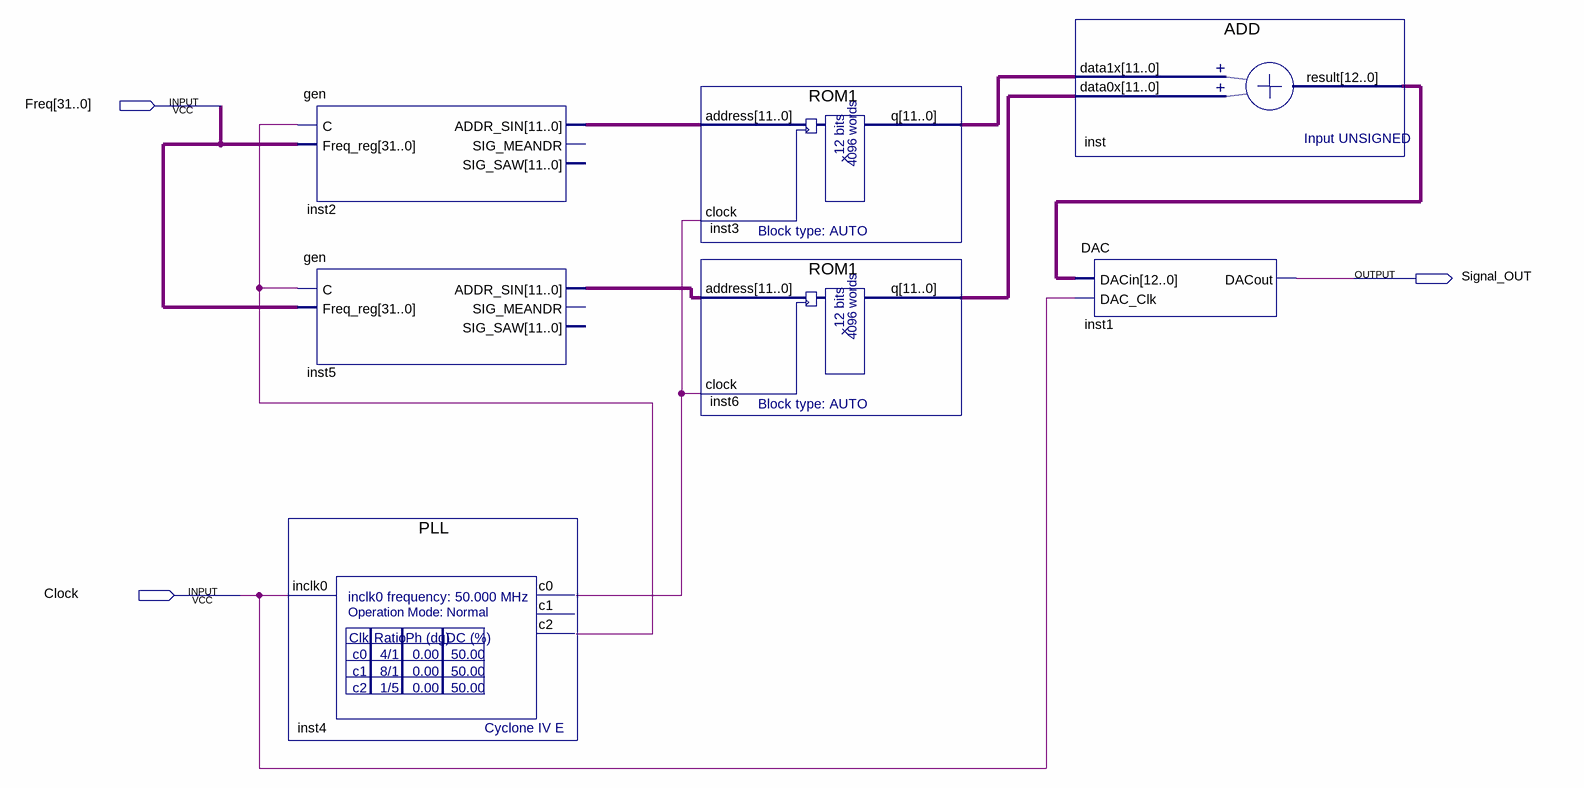
[diagram p0: schematic sheet]
// Quartus schematic TB_2SIN.bdf as structural Verilog: 7 symbols, 3 pins
module TB_2SIN (
  input  [31:0] Freq,
  input  Clock,
  output Signal_OUT
);

  wire inst4_c0, inst4_c2;
  wire [11:0] inst2_addr_sin, inst3_q, inst5_addr_sin, inst6_q;
  wire [12:0] inst_result;

  gen inst2 (.C(inst4_c2), .Freq_reg(Freq), .ADDR_SIN(inst2_addr_sin));  // open: SIG_MEANDR, SIG_SAW
  gen inst5 (.C(inst4_c2), .Freq_reg(Freq), .ADDR_SIN(inst5_addr_sin));  // open: SIG_MEANDR, SIG_SAW
  PLL inst4 (.inclk0(Clock), .c0(inst4_c0), .c2(inst4_c2));  // open: c1
  ROM1 inst3 (.address(inst2_addr_sin), .clock(inst4_c0), .q(inst3_q));
  ROM1 inst6 (.address(inst5_addr_sin), .clock(inst4_c0), .q(inst6_q));
  ADD inst (.data1x(inst3_q), .data0x(inst6_q), .result(inst_result));
  DAC inst1 (.DACin(inst_result), .DAC_Clk(Clock), .DACout(Signal_OUT));
endmodule
